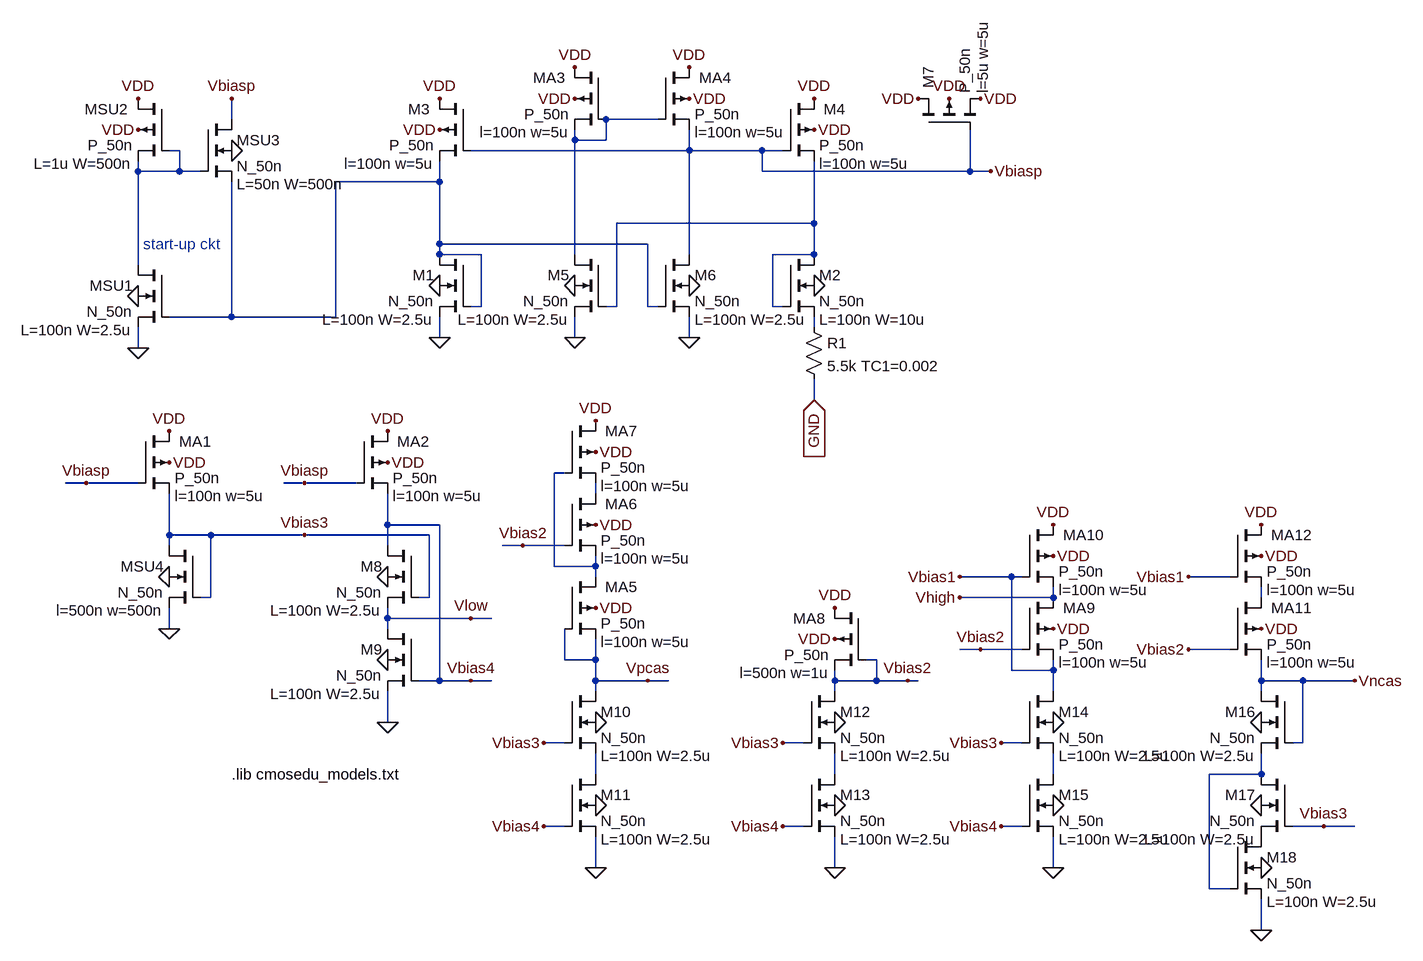
[diagram p0: schematic Fig_20_47.asc]
Fig_20_47.asc, the LTspice schematic file:
Version 4
SHEET 1 2508 1124
WIRE 464 416 432 416
WIRE 544 -64 544 -80
WIRE 544 80 544 -64
WIRE 544 208 544 176
WIRE 544 416 464 416
WIRE 592 496 592 432
WIRE 592 512 592 496
WIRE 592 640 592 608
WIRE 608 -96 592 -96
WIRE 608 -64 544 -64
WIRE 608 -64 608 -96
WIRE 640 -64 608 -64
WIRE 656 496 592 496
WIRE 656 592 640 592
WIRE 656 592 656 496
WIRE 688 -144 688 -176
WIRE 688 160 592 160
WIRE 688 160 688 -48
WIRE 800 416 768 416
WIRE 800 496 656 496
WIRE 848 160 688 160
WIRE 848 160 848 -48
WIRE 880 416 800 416
WIRE 928 480 928 432
WIRE 928 512 928 480
WIRE 928 624 928 608
WIRE 928 640 928 624
WIRE 928 784 928 736
WIRE 992 496 800 496
WIRE 992 592 976 592
WIRE 992 592 992 496
WIRE 1008 -48 848 -48
WIRE 1008 -48 1008 -80
WIRE 1008 48 1008 -48
WIRE 1008 64 1008 48
WIRE 1008 192 1008 160
WIRE 1008 480 928 480
WIRE 1008 720 976 720
WIRE 1008 720 1008 480
WIRE 1056 624 928 624
WIRE 1056 720 1008 720
WIRE 1072 64 1008 64
WIRE 1072 144 1056 144
WIRE 1072 144 1072 64
WIRE 1088 624 1056 624
WIRE 1088 720 1056 720
WIRE 1136 512 1104 512
WIRE 1184 544 1184 400
WIRE 1200 400 1184 400
WIRE 1200 512 1136 512
WIRE 1200 688 1200 640
WIRE 1200 816 1168 816
WIRE 1200 944 1168 944
WIRE 1216 -112 1216 -128
WIRE 1216 64 1216 -112
WIRE 1216 192 1216 160
WIRE 1248 432 1248 416
WIRE 1248 544 1184 544
WIRE 1248 544 1248 528
WIRE 1248 560 1248 544
WIRE 1248 688 1200 688
WIRE 1248 688 1248 656
WIRE 1248 720 1248 688
WIRE 1248 736 1248 720
WIRE 1248 864 1248 832
WIRE 1248 1008 1248 960
WIRE 1264 -112 1216 -112
WIRE 1264 -112 1264 -144
WIRE 1280 144 1264 144
WIRE 1280 144 1280 16
WIRE 1328 48 1008 48
WIRE 1328 144 1328 48
WIRE 1328 720 1248 720
WIRE 1344 -144 1264 -144
WIRE 1344 144 1328 144
WIRE 1360 720 1328 720
WIRE 1392 -96 1056 -96
WIRE 1392 -96 1392 -128
WIRE 1392 64 1392 -96
WIRE 1392 192 1392 160
WIRE 1504 -96 1392 -96
WIRE 1504 -64 1504 -96
WIRE 1520 144 1520 64
WIRE 1536 -96 1504 -96
WIRE 1536 144 1520 144
WIRE 1568 816 1536 816
WIRE 1568 944 1536 944
WIRE 1584 16 1280 16
WIRE 1584 16 1584 -80
WIRE 1584 64 1520 64
WIRE 1584 64 1584 16
WIRE 1584 176 1584 160
WIRE 1584 288 1584 256
WIRE 1616 720 1616 704
WIRE 1616 736 1616 720
WIRE 1616 864 1616 832
WIRE 1616 1008 1616 960
WIRE 1680 688 1664 688
WIRE 1680 720 1616 720
WIRE 1680 720 1680 688
WIRE 1728 720 1680 720
WIRE 1744 720 1728 720
WIRE 1824 -64 1504 -64
WIRE 1824 -64 1824 -128
WIRE 1840 672 1808 672
WIRE 1856 -64 1824 -64
WIRE 1888 560 1808 560
WIRE 1888 704 1888 560
WIRE 1904 560 1888 560
WIRE 1904 672 1840 672
WIRE 1904 816 1872 816
WIRE 1904 944 1872 944
WIRE 1952 592 1808 592
WIRE 1952 592 1952 576
WIRE 1952 704 1888 704
WIRE 1952 704 1952 688
WIRE 1952 736 1952 704
WIRE 1952 864 1952 832
WIRE 1952 1008 1952 960
WIRE 2192 1040 2192 864
WIRE 2224 560 2160 560
WIRE 2224 672 2160 672
WIRE 2224 1040 2192 1040
WIRE 2272 592 2272 576
WIRE 2272 720 2272 688
WIRE 2272 736 2272 720
WIRE 2272 864 2192 864
WIRE 2272 864 2272 832
WIRE 2272 1104 2272 1056
WIRE 2336 720 2272 720
WIRE 2336 816 2320 816
WIRE 2336 816 2336 720
WIRE 2368 944 2320 944
WIRE 2416 720 2336 720
WIRE 2416 944 2368 944
FLAG 544 -128 VDD
FLAG 544 -176 VDD
FLAG 544 208 0
FLAG 544 128 0
FLAG 688 -96 0
FLAG 688 -176 Vbiasp
FLAG 1008 -128 VDD
FLAG 1008 -176 VDD
FLAG 1584 -128 VDD
FLAG 1584 -176 VDD
FLAG 1856 -64 Vbiasp
FLAG 1008 192 0
FLAG 1008 112 0
FLAG 1584 112 0
FLAG 1392 -176 VDD
FLAG 1392 -224 VDD
FLAG 1216 -176 VDD
FLAG 1216 -224 VDD
FLAG 1216 112 0
FLAG 1392 112 0
FLAG 1216 192 0
FLAG 1392 192 0
FLAG 1792 -176 VDD
FLAG 1744 -176 VDD
FLAG 1840 -176 VDD
FLAG 592 384 VDD
FLAG 592 336 VDD
FLAG 464 416 Vbiasp
FLAG 928 384 VDD
FLAG 928 336 VDD
FLAG 800 416 Vbiasp
FLAG 592 640 0
FLAG 592 560 0
FLAG 928 560 0
FLAG 928 688 0
FLAG 928 784 0
FLAG 800 496 Vbias3
FLAG 1248 784 0
FLAG 1248 912 0
FLAG 1248 1008 0
FLAG 1056 624 Vlow
FLAG 1056 720 Vbias4
FLAG 1168 816 Vbias3
FLAG 1168 944 Vbias4
FLAG 1616 784 0
FLAG 1616 912 0
FLAG 1616 1008 0
FLAG 1536 816 Vbias3
FLAG 1536 944 Vbias4
FLAG 1952 784 0
FLAG 1952 912 0
FLAG 1952 1008 0
FLAG 1872 816 Vbias3
FLAG 1872 944 Vbias4
FLAG 1248 608 VDD
FLAG 1328 720 Vpcas
FLAG 1248 480 VDD
FLAG 1248 368 VDD
FLAG 1248 320 VDD
FLAG 1136 512 Vbias2
FLAG 1616 656 VDD
FLAG 1616 608 VDD
FLAG 1728 720 Vbias2
FLAG 1952 640 VDD
FLAG 1952 528 VDD
FLAG 1952 480 VDD
FLAG 1840 672 Vbias2
FLAG 1808 560 Vbias1
FLAG 1808 592 Vhigh
FLAG 2272 640 VDD
FLAG 2272 528 VDD
FLAG 2272 480 VDD
FLAG 2160 560 Vbias1
FLAG 2160 672 Vbias2
FLAG 2272 784 0
FLAG 2272 912 0
FLAG 2272 1008 0
FLAG 2272 1104 0
FLAG 2416 720 Vncas
FLAG 2368 944 Vbias3
FLAG 1584 288 GND
IOPIN 1584 288 In
SYMBOL pmos4 592 -176 M0
WINDOW 0 63 16 Left 0
WINDOW 123 56 100 Left 0
SYMATTR InstName MSU2
SYMATTR Value2 L=1u W=500n
SYMATTR Value P_50n
SYMBOL nmos4 592 80 M0
WINDOW 123 56 100 Left 0
SYMATTR Value2 L=100n W=2.5u
SYMATTR InstName MSU1
SYMATTR Value N_50n
SYMBOL nmos4 640 -144 R0
WINDOW 123 56 100 Left 0
SYMATTR Value2 L=50n W=500n
SYMATTR InstName MSU3
SYMATTR Value N_50n
SYMBOL pmos4 1056 -176 M0
WINDOW 0 63 16 Left 0
WINDOW 123 56 100 Left 0
SYMATTR InstName M3
SYMATTR Value2 l=100n w=5u
SYMATTR Value P_50n
SYMBOL pmos4 1536 -176 R0
WINDOW 0 63 16 Left 0
WINDOW 123 56 100 Left 0
SYMATTR InstName M4
SYMATTR Value2 l=100n w=5u
SYMATTR Value P_50n
SYMBOL nmos4 1056 64 M0
WINDOW 123 56 100 Left 0
SYMATTR Value2 L=100n W=2.5u
SYMATTR InstName M1
SYMATTR Value N_50n
SYMBOL nmos4 1536 64 R0
WINDOW 123 56 100 Left 0
SYMATTR Value2 L=100n W=10u
SYMATTR InstName M2
SYMATTR Value N_50n
SYMBOL res 1568 160 R0
SYMATTR InstName R1
SYMATTR Value 5.5k TC1=0.002
SYMBOL pmos4 1344 -224 R0
WINDOW 0 63 16 Left 0
WINDOW 123 56 100 Left 0
SYMATTR InstName MA4
SYMATTR Value2 l=100n w=5u
SYMATTR Value P_50n
SYMBOL pmos4 1264 -224 M0
WINDOW 0 63 16 Left 0
WINDOW 123 56 100 Left 0
SYMATTR InstName MA3
SYMATTR Value2 l=100n w=5u
SYMATTR Value P_50n
SYMBOL nmos4 1264 64 M0
WINDOW 123 56 100 Left 0
SYMATTR Value2 L=100n W=2.5u
SYMATTR InstName M5
SYMATTR Value N_50n
SYMBOL nmos4 1344 64 R0
WINDOW 123 56 100 Left 0
SYMATTR Value2 L=100n W=2.5u
SYMATTR InstName M6
SYMATTR Value N_50n
SYMBOL pmos4 1744 -128 R270
WINDOW 0 63 16 Left 0
WINDOW 123 56 100 Left 0
SYMATTR InstName M7
SYMATTR Value2 l=5u w=5u
SYMATTR Value P_50n
SYMBOL pmos4 544 336 R0
WINDOW 0 63 16 Left 0
WINDOW 123 56 100 Left 0
SYMATTR InstName MA1
SYMATTR Value2 l=100n w=5u
SYMATTR Value P_50n
SYMBOL pmos4 880 336 R0
WINDOW 0 63 16 Left 0
WINDOW 123 56 100 Left 0
SYMATTR InstName MA2
SYMATTR Value2 l=100n w=5u
SYMATTR Value P_50n
SYMBOL nmos4 640 512 M0
WINDOW 123 56 100 Left 0
SYMATTR Value2 l=500n w=500n
SYMATTR InstName MSU4
SYMATTR Value N_50n
SYMBOL nmos4 976 512 M0
WINDOW 123 56 100 Left 0
SYMATTR Value2 L=100n W=2.5u
SYMATTR InstName M8
SYMATTR Value N_50n
SYMBOL nmos4 976 640 M0
WINDOW 123 56 100 Left 0
SYMATTR Value2 L=100n W=2.5u
SYMATTR InstName M9
SYMATTR Value N_50n
SYMBOL nmos4 1200 736 R0
WINDOW 123 56 100 Left 0
SYMATTR Value2 L=100n W=2.5u
SYMATTR InstName M10
SYMATTR Value N_50n
SYMBOL nmos4 1200 864 R0
WINDOW 123 56 100 Left 0
SYMATTR Value2 L=100n W=2.5u
SYMATTR InstName M11
SYMATTR Value N_50n
SYMBOL nmos4 1568 736 R0
WINDOW 123 56 100 Left 0
SYMATTR Value2 L=100n W=2.5u
SYMATTR InstName M12
SYMATTR Value N_50n
SYMBOL nmos4 1568 864 R0
WINDOW 123 56 100 Left 0
SYMATTR Value2 L=100n W=2.5u
SYMATTR InstName M13
SYMATTR Value N_50n
SYMBOL nmos4 1904 736 R0
WINDOW 123 56 100 Left 0
SYMATTR Value2 L=100n W=2.5u
SYMATTR InstName M14
SYMATTR Value N_50n
SYMBOL nmos4 1904 864 R0
WINDOW 123 56 100 Left 0
SYMATTR Value2 L=100n W=2.5u
SYMATTR InstName M15
SYMATTR Value N_50n
SYMBOL pmos4 1200 560 R0
WINDOW 0 63 16 Left 0
WINDOW 123 56 100 Left 0
SYMATTR InstName MA5
SYMATTR Value2 l=100n w=5u
SYMATTR Value P_50n
SYMBOL pmos4 1200 432 R0
WINDOW 0 63 16 Left 0
WINDOW 123 56 100 Left 0
SYMATTR InstName MA6
SYMATTR Value2 l=100n w=5u
SYMATTR Value P_50n
SYMBOL pmos4 1200 320 R0
WINDOW 0 63 16 Left 0
WINDOW 123 56 100 Left 0
SYMATTR InstName MA7
SYMATTR Value2 l=100n w=5u
SYMATTR Value P_50n
SYMBOL pmos4 1664 608 M0
WINDOW 0 63 16 Left 0
WINDOW 123 56 100 Left 0
SYMATTR InstName MA8
SYMATTR Value2 l=500n w=1u
SYMATTR Value P_50n
SYMBOL pmos4 1904 592 R0
WINDOW 0 63 16 Left 0
WINDOW 123 56 100 Left 0
SYMATTR InstName MA9
SYMATTR Value2 l=100n w=5u
SYMATTR Value P_50n
SYMBOL pmos4 1904 480 R0
WINDOW 0 63 16 Left 0
WINDOW 123 56 100 Left 0
SYMATTR InstName MA10
SYMATTR Value2 l=100n w=5u
SYMATTR Value P_50n
SYMBOL pmos4 2224 592 R0
WINDOW 0 63 16 Left 0
WINDOW 123 56 100 Left 0
SYMATTR InstName MA11
SYMATTR Value2 l=100n w=5u
SYMATTR Value P_50n
SYMBOL pmos4 2224 480 R0
WINDOW 0 63 16 Left 0
WINDOW 123 56 100 Left 0
SYMATTR InstName MA12
SYMATTR Value2 l=100n w=5u
SYMATTR Value P_50n
SYMBOL nmos4 2320 736 M0
WINDOW 123 56 100 Left 0
SYMATTR Value2 L=100n W=2.5u
SYMATTR InstName M16
SYMATTR Value N_50n
SYMBOL nmos4 2320 864 M0
WINDOW 123 56 100 Left 0
SYMATTR Value2 L=100n W=2.5u
SYMATTR InstName M17
SYMATTR Value N_50n
SYMBOL nmos4 2224 960 R0
WINDOW 123 56 100 Left 0
SYMATTR Value2 L=100n W=2.5u
SYMATTR InstName M18
SYMATTR Value N_50n
TEXT 552 48 Left 0 ;start-up ckt
TEXT 688 864 Left 0 !.lib cmosedu_models.txt

The netlist it stands for:
* Fig_20_47.asc
MSU2 VDD N001 N001 VDD P_50n L=1u W=500n
MSU1 N001 N002 0 0 N_50n L=100n W=2.5u
MSU3 Vbiasp N001 N002 0 N_50n L=50n W=500n
M3 VDD Vbiasp N002 VDD P_50n l=100n w=5u
M4 VDD Vbiasp N007 VDD P_50n l=100n w=5u
M1 N002 N002 0 0 N_50n L=100n W=2.5u
M2 N007 N007 N008 0 N_50n L=100n W=10u
R1 N008 GND 5.5k TC1=0.002
MA4 VDD N004 Vbiasp VDD P_50n l=100n w=5u
MA3 VDD N004 N004 VDD P_50n l=100n w=5u
M5 N004 N007 0 0 N_50n L=100n W=2.5u
M6 Vbiasp N002 0 0 N_50n L=100n W=2.5u
M7 VDD Vbiasp VDD VDD P_50n l=5u w=5u
MA1 VDD Vbiasp Vbias3 VDD P_50n l=100n w=5u
MA2 VDD Vbiasp Vbias4 VDD P_50n l=100n w=5u
MSU4 Vbias3 Vbias3 0 0 N_50n l=500n w=500n
M8 Vbias4 Vbias3 Vlow 0 N_50n L=100n W=2.5u
M9 Vlow Vbias4 0 0 N_50n L=100n W=2.5u
M10 Vpcas Vbias3 N006 0 N_50n L=100n W=2.5u
M11 N006 Vbias4 0 0 N_50n L=100n W=2.5u
M12 Vbias2 Vbias3 N009 0 N_50n L=100n W=2.5u
M13 N009 Vbias4 0 0 N_50n L=100n W=2.5u
M14 Vbias1 Vbias3 N010 0 N_50n L=100n W=2.5u
M15 N010 Vbias4 0 0 N_50n L=100n W=2.5u
MA5 N003 Vpcas Vpcas VDD P_50n l=100n w=5u
MA6 N005 Vbias2 N003 VDD P_50n l=100n w=5u
MA7 VDD N003 N005 VDD P_50n l=100n w=5u
MA8 VDD Vbias2 Vbias2 VDD P_50n l=500n w=1u
MA9 Vhigh Vbias2 Vbias1 VDD P_50n l=100n w=5u
MA10 VDD Vbias1 Vhigh VDD P_50n l=100n w=5u
MA11 N012 Vbias2 Vncas VDD P_50n l=100n w=5u
MA12 VDD Vbias1 N012 VDD P_50n l=100n w=5u
M16 Vncas Vncas N011 0 N_50n L=100n W=2.5u
M17 N011 Vbias3 P001 0 N_50n L=100n W=2.5u
M18 P001 N011 0 0 N_50n L=100n W=2.5u
.model NMOS NMOS
.model PMOS PMOS
.lib standard.mos
* start-up ckt
.lib cmosedu_models.txt
.backanno
.end